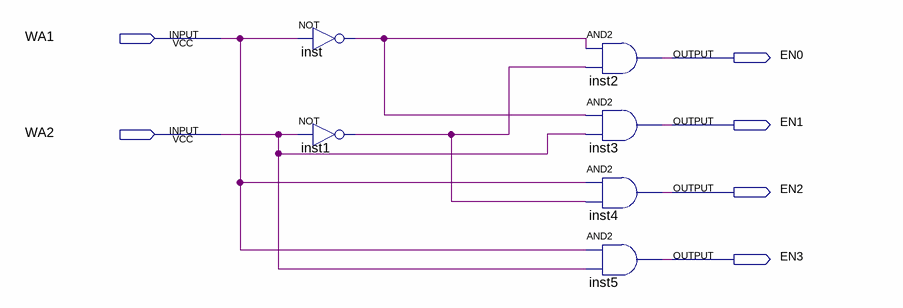
[diagram p0: schematic sheet]
// Quartus schematic Decoder.bdf as structural Verilog: 6 symbols, 6 pins
module Decoder (
  input  WA1,
  input  WA2,
  output EN0,
  output EN1,
  output EN2,
  output EN3
);

  wire inst1_out, inst_out;

  not inst (inst_out, WA1);
  not inst1 (inst1_out, WA2);
  and inst2 (EN0, inst_out, inst1_out);
  and inst3 (EN1, inst_out, WA2);
  and inst4 (EN2, WA1, inst1_out);
  and inst5 (EN3, WA1, WA2);
endmodule
